# Altium schematic sheet 原理图.SchDoc
size A3
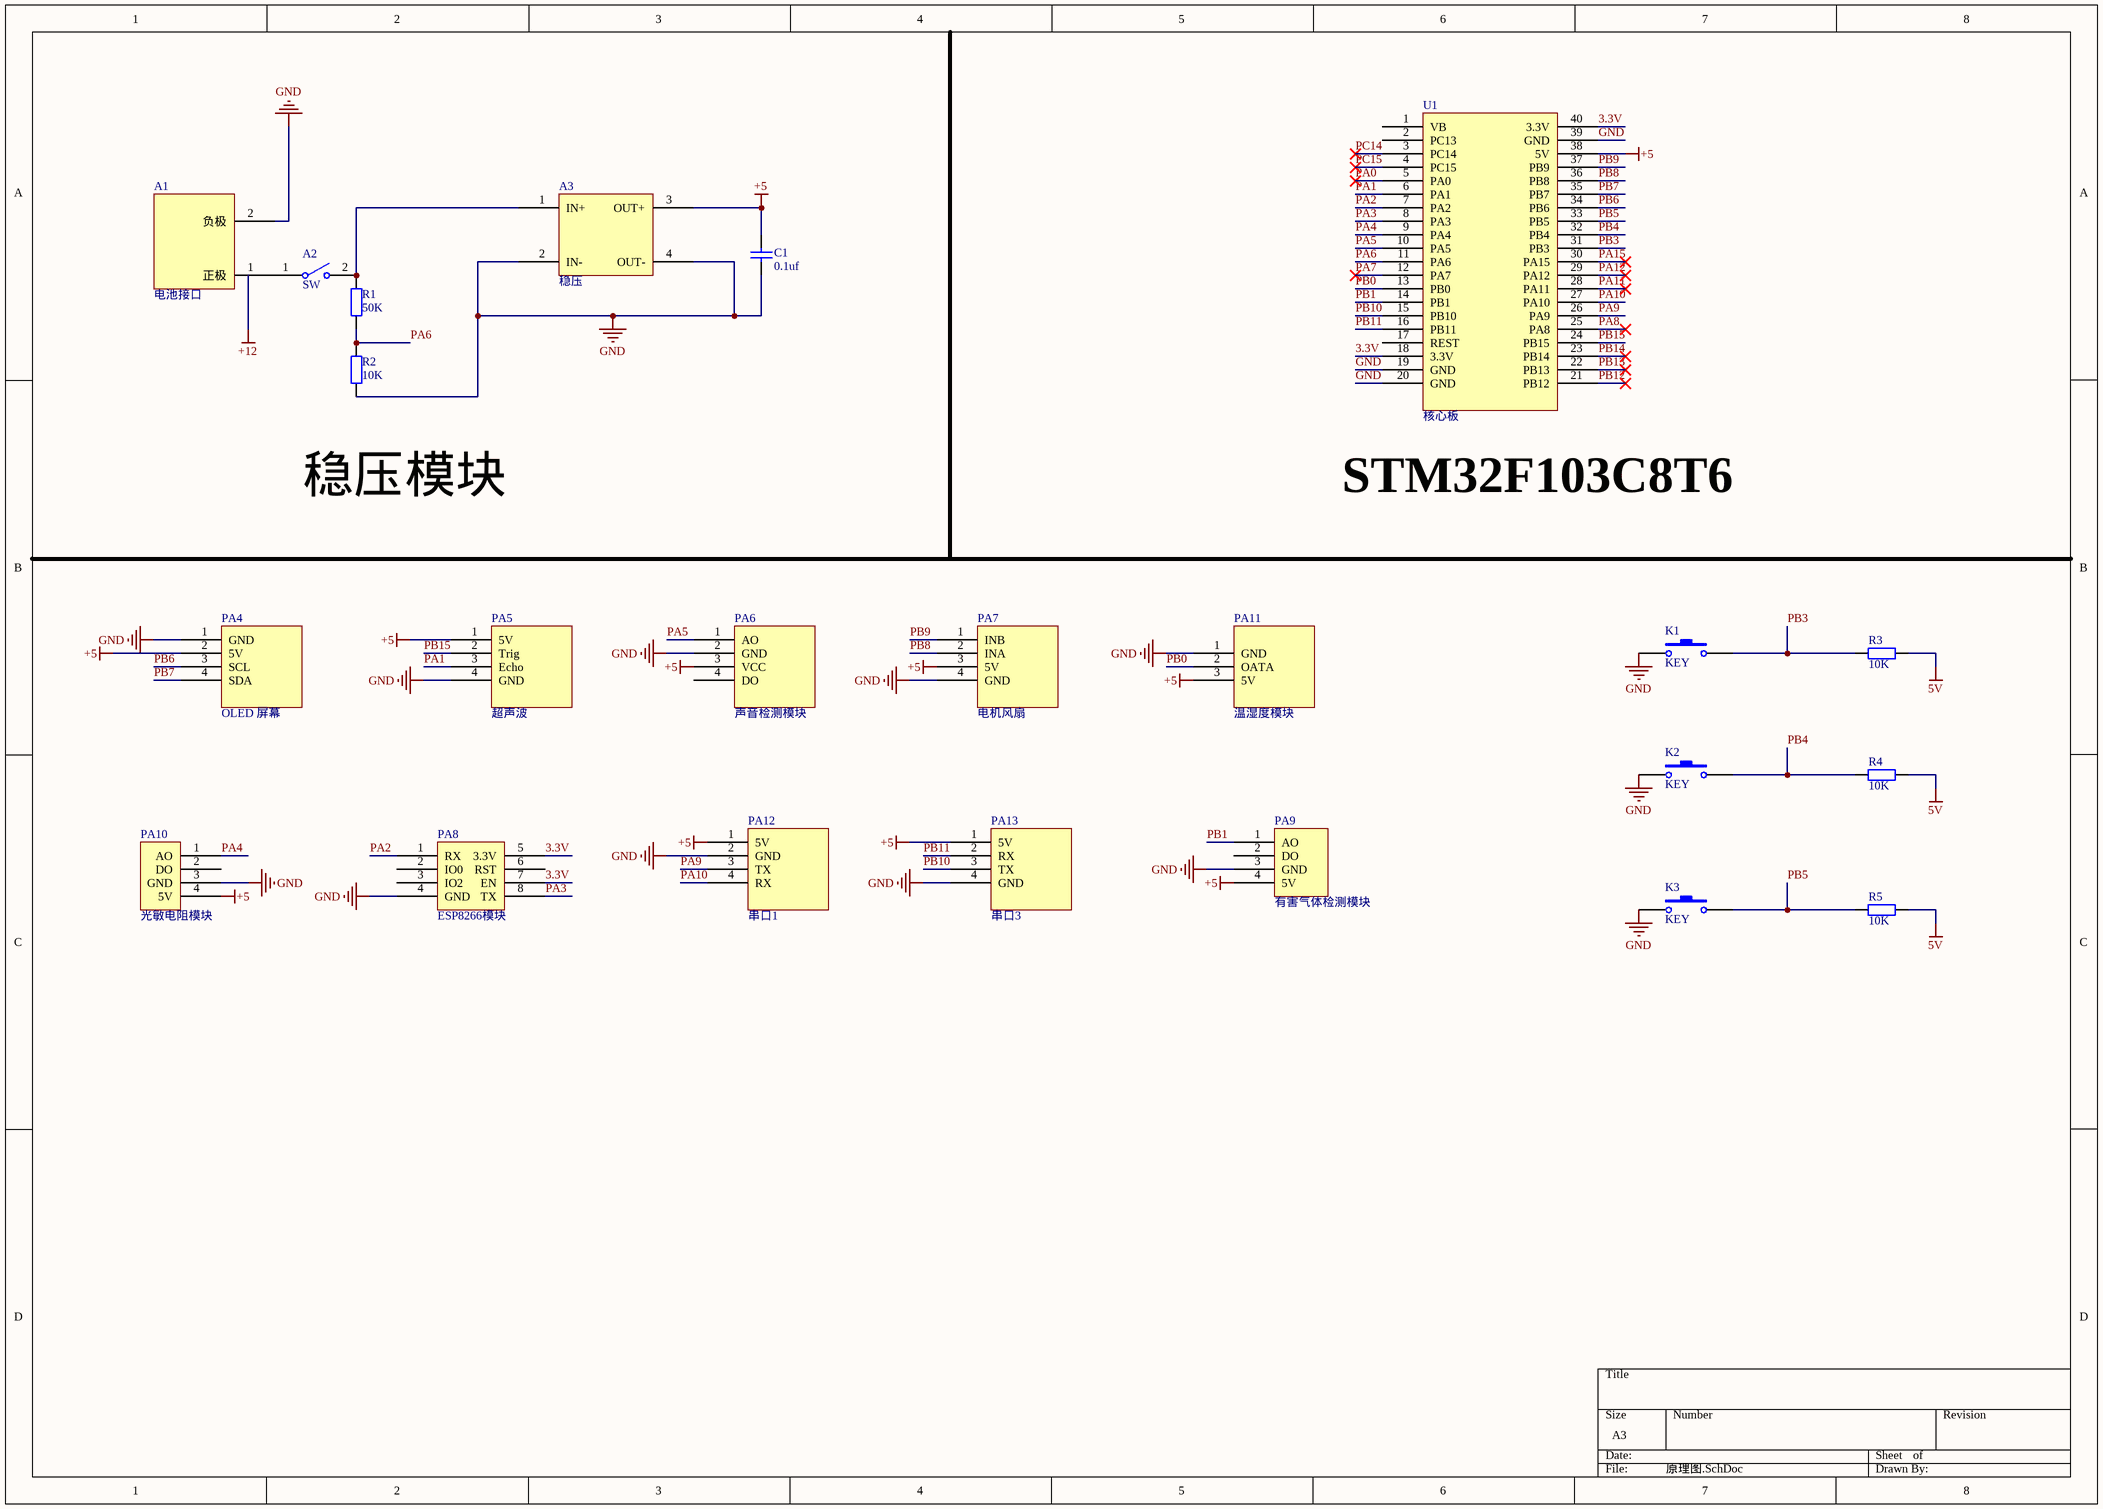
[diagram p0: 原理图.SchDoc]

## Parts
A1  电池接口  [电池接口]
A2  SW  [开关6脚]
A3  稳压  [lm2596]
C1  0.1uf  [电容]
K1  KEY  [按键2脚]
K2  KEY  [按键2脚]
K3  KEY  [按键2脚]
PA4  OLED 屏幕  [OLED]
PA5  超声波  [超声波]
PA6  声音检测模块  [声音检测模块]
PA7  电机风扇  [电机]
PA8  ESP8266模块  [ESP8266]
PA9  有害气体检测模块  [有害气体检测模块]
PA10  光敏电阻模块  [光敏电阻]
PA11  温湿度模块  [温湿度检测模块]
PA12  串口1  [串口1]
PA13  串口3  [串口3]
R1  50K  [电阻]
R2  10K  [电阻]
R3  10K  [电阻]
R4  10K  [电阻]
R5  10K  [电阻]
U1  核心板  [stm32f103c8t6]

## Nets
5V: R3.1 R4.1 R5.1
+5: A3.3(OUT+) C1.2 PA4.2(5V) PA5.1(5V) PA6.3(VCC) PA7.3(5V) PA9.4(5V) PA10.4(5V) PA11.3(5V) PA12.1(5V) PA13.1(5V) U1.38(5V)
GND: A1.2(负极) A3.2(IN-) A3.4(OUT-) C1.1 K1.1 K2.1 K3.1 PA4.1(GND) PA5.4(GND) PA6.2(GND) PA7.4(GND) PA8.4(GND) PA9.3(GND) PA10.3(GND) PA11.1(GND) PA12.2(GND) PA13.4(GND) R2.2 U1.19(GND) U1.20(GND) U1.39(GND)
3.3V: PA8.5(3.3V) PA8.7(EN) U1.18(3.3V) U1.40(3.3V)
PA0: U1.5(PA0)
PA1: PA5.3(Echo) U1.6(PA1)
PA2: PA8.1(RX) U1.7(PA2)
PA3: PA8.8(TX) U1.8(PA3)
PA4: PA10.1(AO) U1.9(PA4)
PA5: PA6.1(AO) U1.10(PA5)
PA6: R1.2 R2.1 U1.11(PA6)
PA7: U1.12(PA7)
PA8: U1.25(PA8)
PA9: PA12.3(TX) U1.26(PA9)
PA10: PA12.4(RX) U1.27(PA10)
PA11: U1.28(PA11)
PA12: U1.29(PA12)
PA15: U1.30(PA15)
PB0: PA11.2(OATA) U1.13(PB0)
PB1: PA9.1(AO) U1.14(PB1)
PB3: K1.2 R3.2 U1.31(PB3)
PB4: K2.2 R4.2 U1.32(PB4)
PB5: K3.2 R5.2 U1.33(PB5)
PB6: PA4.3(SCL) U1.34(PB6)
PB7: PA4.4(SDA) U1.35(PB7)
PB8: PA7.2(INA) U1.36(PB8)
PB9: PA7.1(INB) U1.37(PB9)
PB10: PA13.3(TX) U1.15(PB10)
PB11: PA13.2(RX) U1.16(PB11)
PB12: U1.21(PB12)
PB13: U1.22(PB13)
PB14: U1.23(PB14)
PB15: PA5.2(Trig) U1.24(PB15)
PC14: U1.3(PC14)
PC15: U1.4(PC15)
NetA1_1: A1.1(正极) A2.1(COMMON)
NetA2_2: A2.2(NO) A3.1(IN+) R1.1

Not connected (* = marked no-connect by the designer): PA6 4(DO); PA8 2(IO0) 3(IO2) 6(RST); PA9 2(DO); PA10 2(DO); U1 1(VB) 2(PC13) 17(REST)

## Notes on the sheet
- Labels drawn without touching a wire or pin: STM32F103C8T6, 稳压模块

## Library data of the parts
C1 = CAP0.1
K1-K3 = KEY0.2
R1-R5 = RES0.3